# EAGLE design i2c-infrared-proximity-sensor (EAGLE 5.11)
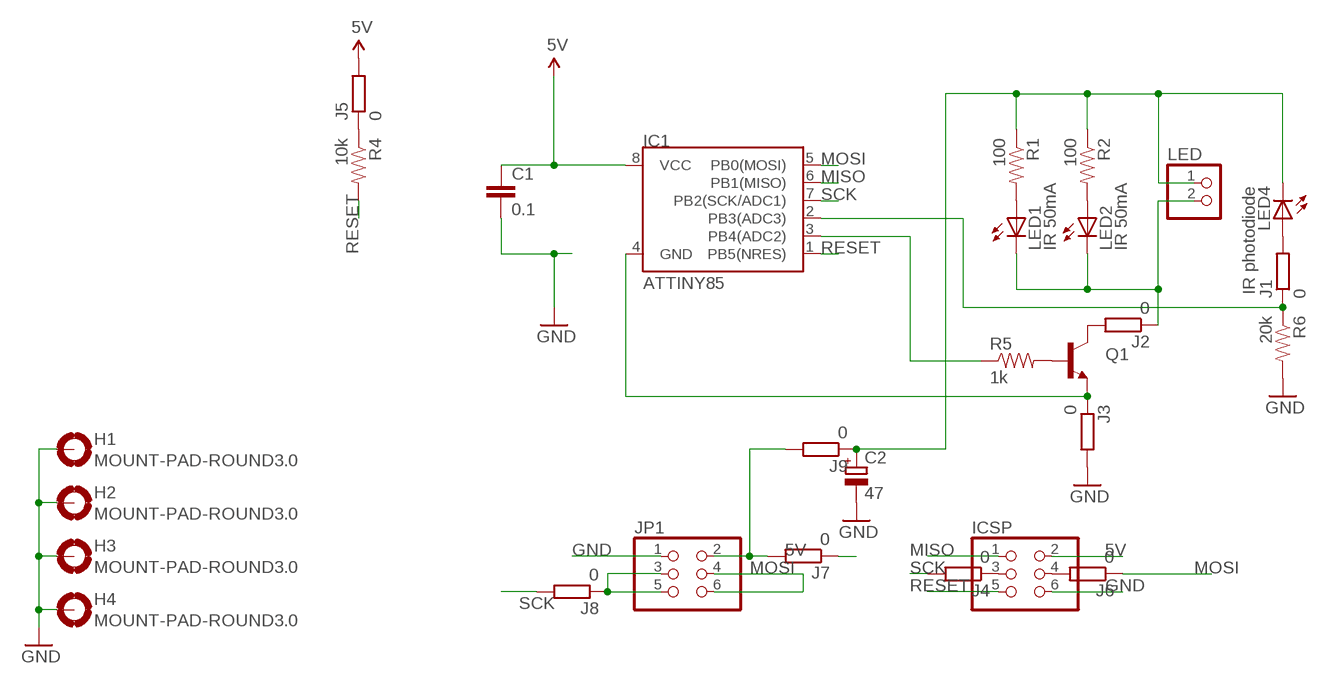
[diagram p0: schematic, sheet 1]

## Parts
C1  0.1  C-EUC0805  [C0805]
C2  47  CPOL-EUSMCC  [SMC_C]
H1  MOUNT-PAD-ROUND3.0  [3,0-PAD]
H2  MOUNT-PAD-ROUND3.0  [3,0-PAD]
H3  MOUNT-PAD-ROUND3.0  [3,0-PAD]
H4  MOUNT-PAD-ROUND3.0  [3,0-PAD]
IC1  ATTINY85  ATTINY45  [SO08-EIAJ]
ICSP  PINHD-2X3  [2X03]
J1  0  R-EU_R1206  [R1206]
J2  0  R-EU_R1206  [R1206]
J3  0  R-EU_R1206  [R1206]
J4  0  R-EU_R1206  [R1206]
J5  0  R-EU_R1206  [R1206]
J6  0  R-EU_R1206  [R1206]
J7  0  R-EU_R1206  [R1206]
J8  0  R-EU_R1206  [R1206]
J9  0  R-EU_R1206  [R1206]
JP1  PINHD-2X3/90  [2X03/90]
LED  PINHD-1X2  [1X02]
LED1  IR 50mA  LED5MM  [LED5MM]
LED2  IR 50mA  LED5MM  [LED5MM]
LED4  IR photodiode  LED5MM  [LED5MM]
Q1  TRANSISTOR_NPNSOT23  [SOT23]
R1  100  RESISTOR0805-RES  [0805]
R2  100  RESISTOR0805-RES  [0805]
R4  10k  RESISTOR0805-RES  [0805]
R5  1k  RESISTOR0805-RES  [0805]
R6  20k  RESISTOR0805-RES  [0805]

## Nets
5V: C1.1 IC1.8(VCC) ICSP.2 J5.2 J7.1
GND: C1.2 C2.- H1.B3,0(MOUNT) H2.B3,0(MOUNT) H3.B3,0(MOUNT) H4.B3,0(MOUNT) ICSP.6 J3.2 JP1.1 R6.2
MISO: IC1.6(PB1(MISO)) ICSP.1
MOSI: IC1.5(PB0(MOSI)) J6.1 JP1.4 JP1.6
N$1: Q1.1(B) R5.2
N$2: LED1.A R1.2
N$3: LED2.A R2.2
N$4: J1.2 LED4.A
N$5: J2.1 LED1.K(C) LED2.K(C) LED.2
N$6: IC1.3(PB4(ADC2)) R5.1
N$7: J2.2 Q1.3(C)
N$8: IC1.2(PB3(ADC3)) J1.1 R6.1
N$9: IC1.4(GND) J3.1 Q1.2(E)
N$10: ICSP.3 J4.1
N$11: J5.1 R4.1
N$12: ICSP.4 J6.2
N$13: J7.2 J9.2 JP1.2
N$14: J8.1 JP1.3 JP1.5
N$16: C2.+ J9.1 LED4.K(C) LED.1 R1.1 R2.1
RESET: IC1.1(PB5(NRES)) ICSP.5 R4.2
SCK: IC1.7(PB2(SCK/ADC1)) J4.2 J8.2

## Library data of the parts
C1 = rcl:C-EU: CAPACITOR, European symbol
C2 = rcl:CPOL-EU: POLARIZED CAPACITOR, European symbol
H1-H4 = holes:MOUNT-PAD-ROUND: MOUNTING PAD, round
IC1 = SparkFun:ATTINY45: Atmel ATTiny45
ICSP = SparkFun:PINHD-2X3: PIN HEADER
J1-J9 = rcl:R-EU_: RESISTOR, European symbol
JP1 = pinhead:PINHD-2X3: PIN HEADER
LED = pinhead:PINHD-1X2: PIN HEADER
LED1 LED2 = SparkFun:LED: LEDs Standard schematic elements and footprints for 5mm, 3mm, 1206, and 0603 sized LEDs. 5mm - Spark Fun Electronics SKU : COM-00529 (and others)
LED4 = led:LED: LED OSRAM: - CHIPLED LG R971, LG N971, LY N971, LG Q971, LY Q971, LO R971, LY R971 LH N974, LH R974 LS Q976, LO Q976, LY Q976 LO Q996 - Hyper CHIPLED LW Q18S LB Q993, LB Q99A, LB R99A - SideLED LS A670, LO A670, LY A670, LG A670, LP A670 LB A673, LV A673, LT A673, LW A673 LH A674 LY A675 LS A676, LA A676, LO A676, LY A676, LW A676 LS A679, LY A679, LG A679 - Hyper Micro SIDELED® LS Y876, LA Y876, LO Y876, LY Y876 LT Y87S - SmartLED LW L88C, LW L88S LB L89C, LB L89S, LG L890 LS L89K, LO L89K, LY L89K LS L896, LA L896, LO L896, LY L896 - TOPLED LS T670, LO T670, LY T670, LG T670, LP T670 LSG T670, LSP T670, LSY T670, LOP T670, LYG T670 LG T671, LOG T671, LSG T671 LB T673, LV T673, LT T673, LW T673 LH T674 LS T676, LA T676, LO T676, LY T676, LB T676, LH T676, LSB T676, LW T676 LB T67C, LV T67C, LT T67C, LS T67K, LO T67K, LY T67K, LW E67C LS E67B, LA E67B, LO E67B, LY E67B, LB E67C, LV E67C, LT E67C LW T67C LS T679, LY T679, LG T679 LS T770, LO T770, LY T770, LG T770, LP T770 LB T773, LV T773, LT T773, LW T773 LH T774 LS E675, LA E675, LY E675, LS T675 LS T776, LA T776, LO T776, LY T776, LB T776 LHGB T686 LT T68C, LB T68C - Hyper Mini TOPLED® LB M676 - Mini TOPLED Santana® LG M470 LS M47K, LO M47K, LY M47K Source: http://www.osram.convergy.de LUXEON: - LUMILED® LXK2-PW12-R00, LXK2-PW12-S00, LXK2-PW14-U00, LXK2-PW14-V00 LXK2-PM12-R00, LXK2-PM12-S00, LXK2-PM14-U00 LXK2-PE12-Q00, LXK2-PE12-R00, LXK2-PE12-S00, LXK2-PE14-T00, LXK2-PE14-U00 LXK2-PB12-K00, LXK2-PB12-L00, LXK2-PB12-M00, LXK2-PB14-N00, LXK2-PB14-P00, LXK2-PB14-Q00 LXK2-PR12-L00, LXK2-PR12-M00, LXK2-PR14-Q00, LXK2-PR14-R00 LXK2-PD12-Q00, LXK2-PD12-R00, LXK2-PD12-S00 LXK2-PH12-R00, LXK2-PH12-S00 LXK2-PL12-P00, LXK2-PL12-Q00, LXK2-PL12-R00 Source: www.luxeon.com KINGBRIGHT: KA-3528ASYC Source: www.kingbright.com
Q1 = SparkFun:TRANSISTOR_NPN: Transistor NPN BJT configuration in SOT23 package. MMBT2222 is the common NPN we use. Double check BCE configuration again layout.
R1 R2 R4-R6 = SparkFun:RESISTOR: Resistor Basic schematic elements and footprints for 0603, 1206, and PTH resistors.

## Board
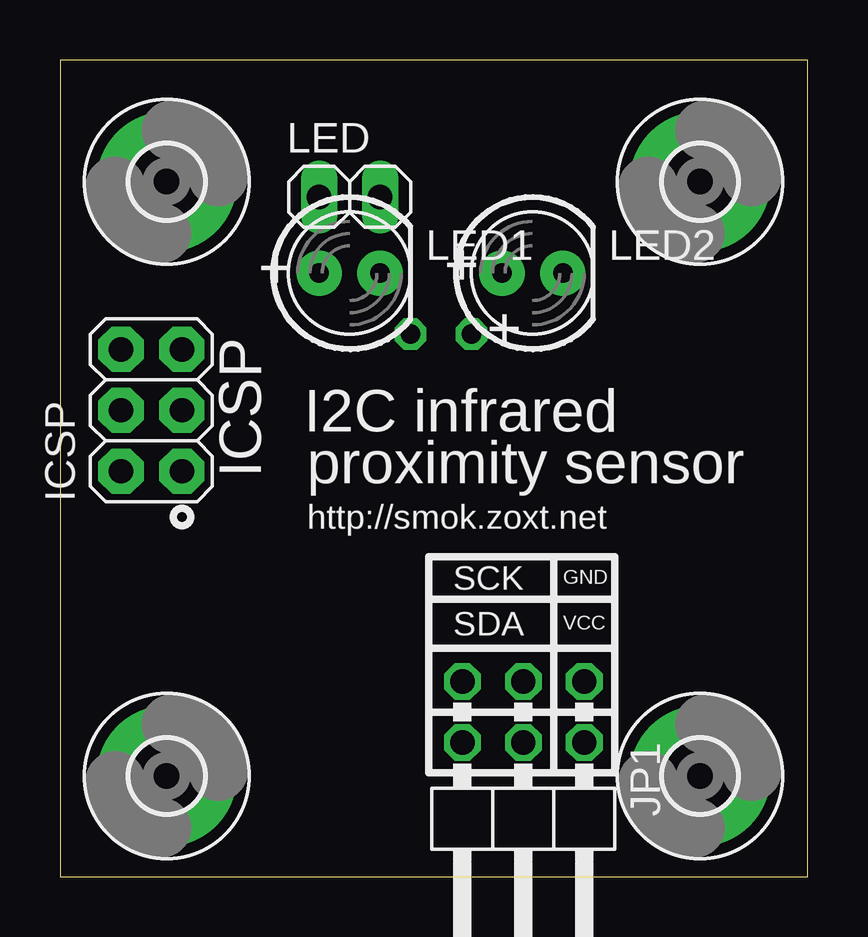
[diagram p1: board, top side]
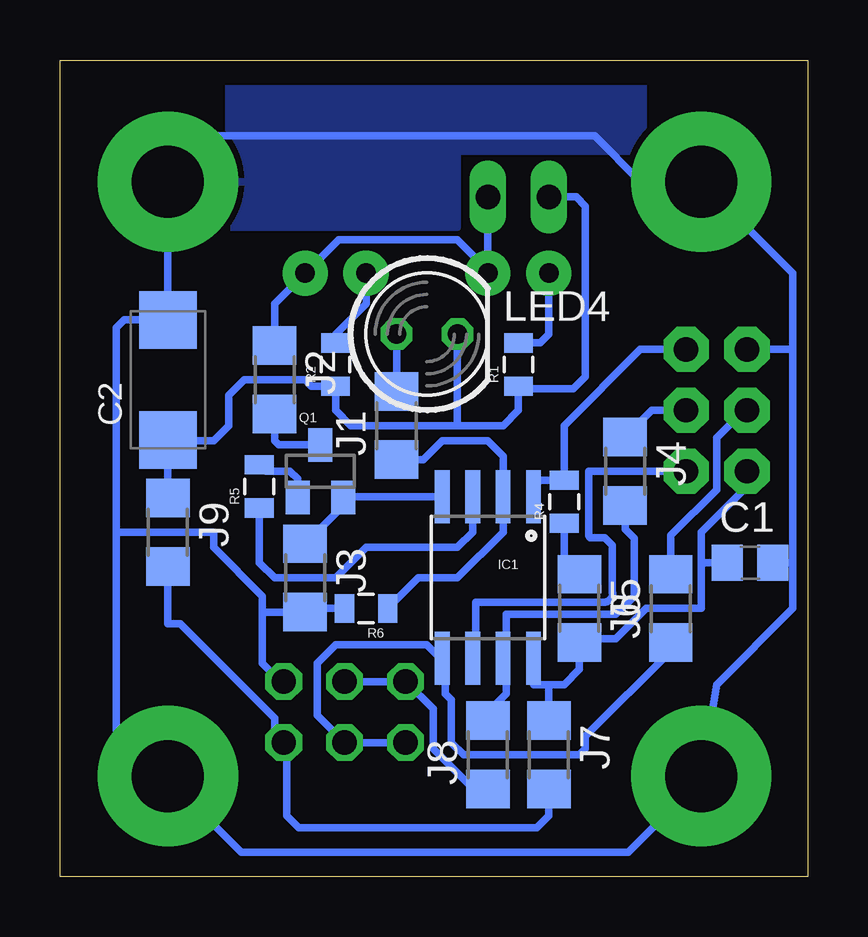
[diagram p2: board, bottom side, seen from below]

Size 31.17 x 34.03 mm. Coordinates in mm from the lower left corner, seen from the top.
Outline: 0,0 31.17,0 31.17,34.03 0,34.03 0,0
Copper layers (1*16): Top 0.035mm / dielectric 1.5mm / Bottom 0.035mm
Design rules "default": minimum track width 10mil, minimum drill 24mil, track to track 8mil, track to pad 8mil, pad to pad 8mil, via to via 8mil, smd to smd 8mil, copper to edge 40mil, drill to drill 8mil, minimum pad ring 10mil, minimum via ring 8mil, stop-mask expansion 4mil, vias tented up to drill 0mil, thermal gap 10mil

### Footprints (pad centres in the part's own frame; a part is rotated, then mirrored left to right if it is on the bottom)
C0805 = smd 1.3 x 1.5: 1 -0.95,0; 2 0.95,0
SMC_C = smd 2.4 x 2.4: + -2.5,0; - 2.5,0
3,0-PAD = drill 3 pad 5.842 round: B3,0 0,0
SO08-EIAJ = smd 0.61 x 2.21: 1 -1.905,-3.378; 2 -0.635,-3.378; 3 0.635,-3.378; 4 1.905,-3.378; 5 1.905,3.353; 6 0.635,3.353; 7 -0.635,3.353; 8 -1.905,3.353
2X03 = drill 1.016 pad 1.88 octagon: 1 -2.54,-1.27; 2 -2.54,1.27; 3 0,-1.27; 4 0,1.27; 5 2.54,-1.27; 6 2.54,1.27
R1206 = smd 1.6 x 1.803: 1 -1.422,0; 2 1.422,0
2X03/90 = drill 1.016 octagon: 1 -2.54,-6.35; 2 -2.54,-3.81; 3 0,-6.35; 4 0,-3.81; 5 2.54,-6.35; 6 2.54,-3.81
1X02 = drill 1.016 long: 1 -1.27,0; 2 1.27,0
LED5MM = drill 0.813 pad 1.88 round: A -1.27,0; K 1.27,0
LED5MM' = drill 0.813 octagon: A -1.27,0; K 1.27,0
SOT23 = smd 1 x 1.4: 1 -0.95,-1.1; 2 0.95,-1.1; 3 0,1.1
0805 = smd 0.8 x 1.2: 1 -0.9,0; 2 0.9,0

### Placement (x,y rotation side)
C1  2.41,13.08 0 bottom
C2  26.67,20.7 90 bottom
H1  26.67,28.96 0 top
H2  4.44,28.96 0 top
H3  26.67,4.19 0 top
H4  4.44,4.19 0 top
IC1  13.34,12.45 180 bottom
ICSP  3.81,19.43 90 top
J1  17.14,18.8 90 bottom
J2  22.22,20.7 270 bottom
J3  20.95,12.45 270 bottom
J4  7.62,16.89 270 bottom
J5  9.53,11.18 270 bottom
J6  5.71,11.18 90 bottom
J7  10.79,5.08 270 bottom
J8  13.34,5.08 90 bottom
J9  26.67,14.35 270 bottom
JP1  19.3,1.78 180 top
LED  12.07,28.32 0 top
LED1  12.07,25.15 0 top
LED2  19.68,25.15 0 top
LED4  IR photodiode  [LED5MM']  15.88,22.61 0 bottom
Q1  20.32,16.89 0 bottom
R1  12.07,21.34 90 bottom
R2  19.68,21.34 90 bottom
R4  10.16,15.62 90 bottom
R5  22.86,16.26 90 bottom
R6  18.41,11.18 180 bottom

### Tracks (layer width: path | path; a pad name or v marks a point on that pad's centre or on a via)
5V
  Bottom 0.305: ICSP.2 2.54,16.26 4.44,14.35 4.44,12.95 | 10.79,8 10.16,8 9.53,8.64 J5.2 9.37,9.91 8,9.91 6.73,11.18 4.44,11.18 4.44,12.95 | 10.79,8 11.43,8 IC1.8 | C1.1 4.32,13.08 4.44,12.95 | 10.79,8 J7.1
GND
  Bottom 0.305: 0.64,21.97 ICSP.6 | 0.64,21.97 0.64,25.15 H2.B3,0 6.99,28.96 8.89,30.86 24.77,30.86 H1.B3,0 C2.- 28.49,23.2 28.83,22.86 28.83,14.35 | 0.64,13.08 0.64,11.18 3.81,8 H4.B3,0 4.44,4.06 7.49,1.02 23.62,1.02 26.8,4.19 26.92,4.19 | 0.64,13.08 0.64,21.97 | R6.2 20.8,11.18 J3.2 22.73,11.02 | 0.64,13.08 C1.2 | H3.B3,0 28.83,6.1 28.83,14.35 | 22.73,11.02 22.73,11.68 24.77,13.72 24.77,14.35 28.83,14.35 | JP1.1 21.97,8.13 22.73,8.89 22.73,11.02
  pour Bottom: 24.13,27.05 24.13,34.04 6.86,34.04 6.86,30.23 14.61,30.23 14.61,27.05
MISO
  Bottom 0.305: ICSP.1 9.14,16.89 9.14,14.2 9.07,14.12 8.46,14.12 8.15,13.82 8.15,11.84 8.13,11.81 arc90 8.51,11.43 13.84,11.43 13.84,9.22 IC1.6
MOSI
  Bottom 0.305: JP1.6 JP1.4 20.45,6.73 20.45,8.89 19.68,9.65 15.88,9.65 15.32,9.09 IC1.5 15.11,8.97 15.11,7.62 14.86,7.37 14.86,5.59 14.35,5.08 9.53,5.08 9.27,5.33 9.27,5.84 5.71,9.4 J6.1
N$1
  Bottom 0.305: Q1.1 21.27,16.57 21.59,16.89 22.59,16.89 R5.2
N$2
  Bottom 0.305: R1.2 11.17,22.24 10.79,22.61 LED1.A
N$3
  Bottom 0.305: R2.2 19.68,22.61 18.41,23.88 LED2.A
N$4
  Bottom 0.305: J1.2 LED4.A
N$5
  Bottom 0.305: LED.2 LED1.K 13.34,25.27 14.61,26.54 19.56,26.54 LED2.K 22.22,23.88 J2.1
N$6
  Bottom 0.305: R5.1 22.86,13.08 22.22,12.45 19.68,12.45 18.41,13.72 14.61,13.72 13.97,14.35 IC1.3
N$7
  Bottom 0.305: Q1.3 22.05,17.99 22.22,18.16 J2.2
N$8
  Bottom 0.305: J1.1 16.03,17.37 15.24,18.16 13.34,18.16 12.7,17.53 IC1.2 12.7,14.35 14.61,12.45 16.24,12.45 R6.1
N$9
  Bottom 0.305: IC1.4 19.34,15.82 Q1.2 19.37,15.45 J3.1
N$10
  Bottom 0.305: ICSP.3 6.5,19.43 J4.1
N$11
  Bottom 0.305: R4.1 10.16,13.23 J5.1
N$12
  Bottom 0.305: ICSP.4 2.67,19.43 3.81,18.29 3.81,16.13 5.71,14.22 J6.2
N$13
  Bottom 0.305: J7.2 10.79,2.54 11.3,2.03 21.21,2.03 21.72,2.54 21.72,5.46 JP1.2 22.22,5.97 22.22,6.6 26.16,10.54 26.67,10.54 J9.2
N$14
  Bottom 0.305: JP1.3 JP1.5 15.62,6.98 15.62,5.33 13.95,3.66 J8.1
N$16
  Bottom 0.305: 14.61,18.8 12.7,18.8 12.07,19.43 R1.1 11.95,20.32 9.78,20.32 9.27,20.83 9.27,27.94 9.65,28.32 LED.1 | 14.61,18.8 19.05,18.8 19.68,19.43 R2.1 20.69,20.44 20.95,20.7 23.49,20.7 24.13,20.07 24.13,18.8 24.77,18.16 26.67,18.16 C2.+ J9.1 | 14.61,18.8 LED4.K
RESET
  Bottom 0.305: ICSP.5 6.99,21.97 10.16,18.8 R4.2 11.17,16.52 11.43,16.26 IC1.1
SCK
  Bottom 0.305: J4.2 7.62,14.48 7.24,14.1 7.24,11.68 8,10.92 12.57,10.92 12.57,9.22 IC1.7 12.57,8.97 12.57,7.62 13.34,6.86 J8.2

### Text on the board
_tsilk: + | + | + | I2C infrared | ICSP | proximity sensor | http://smok.zoxt.net | SCK | GND | VCC | SDA